# EAGLE design sensor_board_Final (EAGLE 9.6.2)
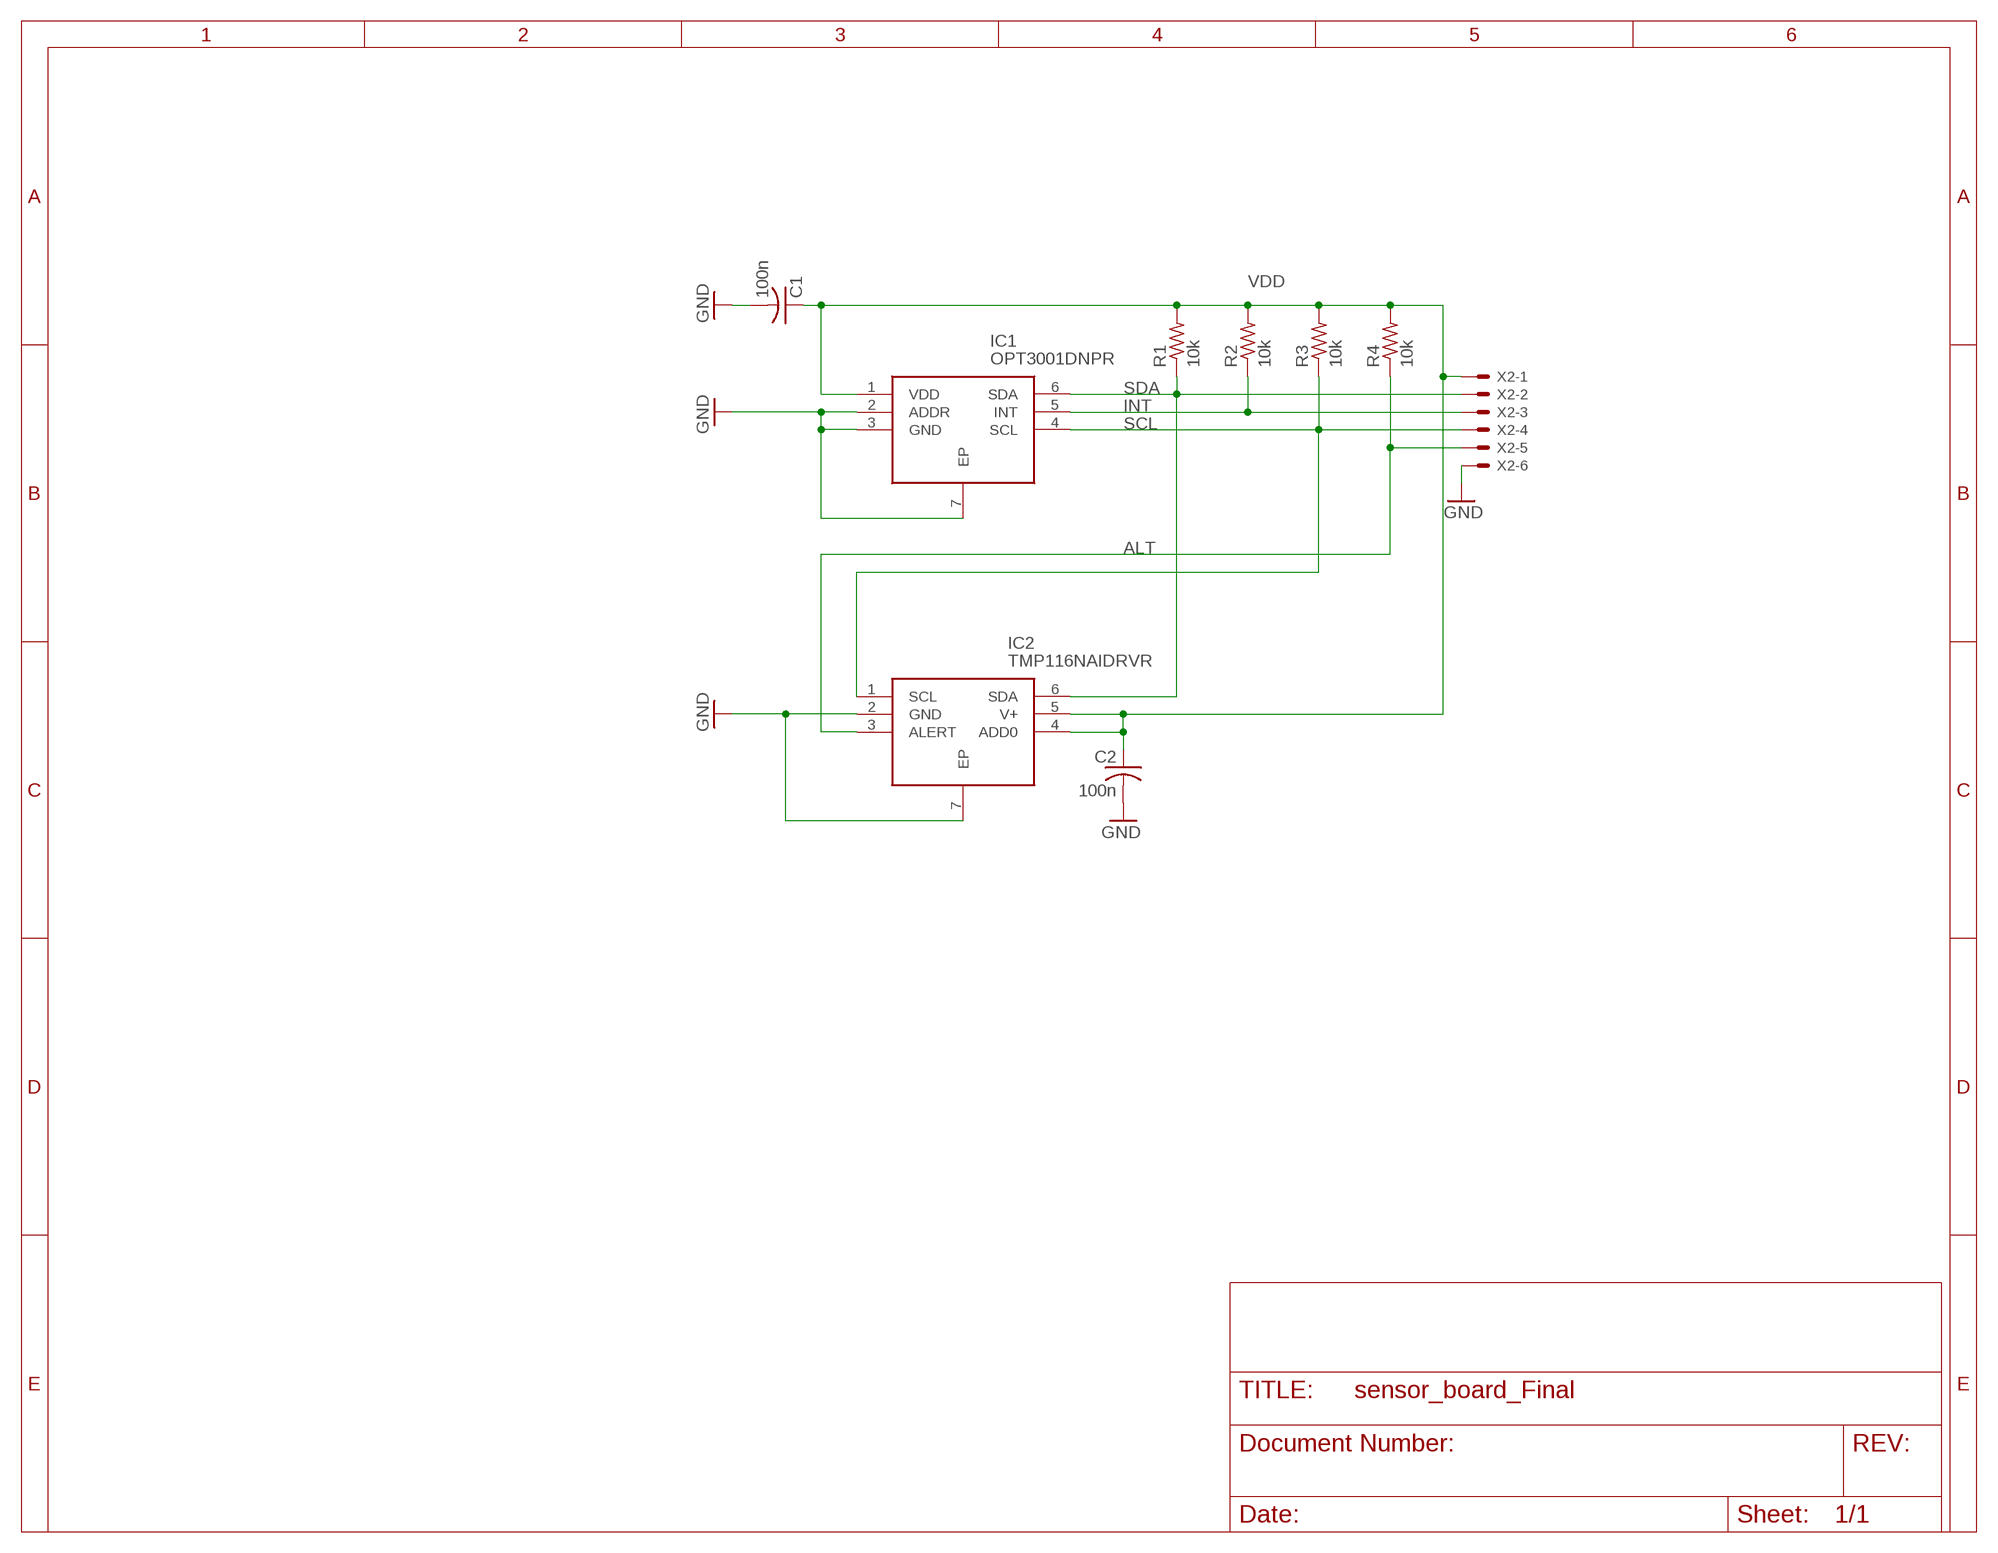
[diagram p0: schematic, sheet 1]

## Parts
C1  100n  C-USC0805  [C0805]
C2  100n  C-USC0805  [C0805]
IC1  OPT3001DNPR  [SON65P200X200X65-7N]
IC2  TMP116NAIDRVR  [SON65P200X200X80-7N]
R1  10k  R-US_R0603  [R0603]
R2  10k  R-US_R0603  [R0603]
R3  10k  R-US_R0603  [R0603]
R4  10k  R-US_R0603  [R0603]
X2  22-23-2061  [22-23-2061]

## Nets
ALT: IC2.3(ALERT) R4.1 X2.5
GND [power]: C1.2 C2.2 IC1.2(ADDR) IC1.3(GND) IC1.7(EP) IC2.2(GND) IC2.7(EP) X2.6
INT: IC1.5(INT) R2.1 X2.3
SCL: IC1.4(SCL) IC2.1(SCL) R3.1 X2.4
SDA: IC1.6(SDA) IC2.6(SDA) R1.1 X2.2
VDD [power]: C1.1 C2.1 IC1.1(VDD) IC2.4(ADD0) IC2.5(V+) R1.2 R2.2 R3.2 R4.2 X2.1

## Library data of the parts
C1 C2 = rcl:C-US: CAPACITOR, American symbol; SPICEPREFIX: C
IC1 = OPT3001DNPR:OPT3001DNPR: Digital Ambient Light Sensor (ALS) With High-Precision Human-Eye Response Source: Datasheet <http://www.ti.com/lit/gpn/opt3001>; ARROW_PART_NUMBER: OPT3001DNPR; ARROW_PRICE-STOCK: https://www.arrow.com/en/products/opt3001dnpr/texas-instruments; DESCRIPTION: Digital Ambient Light Sensor (ALS) With High-Precision Human-Eye Response; HEIGHT: 0.65mm; MANUFACTURER_NAME: Texas Instruments; MANUFACTURER_PART_NUMBER: OPT3001DNPR; MOUSER_PART_NUMBER: 595-OPT3001DNPR; MOUSER_PRICE-STOCK: https://www.mouser.co.uk/ProductDetail/Texas-Instruments/OPT3001DNPR?qs=bZA2O%252B%252B1GJtKOS2%252BWqaE4Q%3D%3D
IC2 = TMP116NAIDRVR:TMP116NAIDRVR: +/-0.2C Accurate Digital Temperature Sensor With NV Memory Source: Datasheet <http://www.ti.com/lit/gpn/tmp116>; ARROW_PART_NUMBER: TMP116NAIDRVR; ARROW_PRICE-STOCK: https://www.arrow.com/en/products/tmp116naidrvr/texas-instruments; DESCRIPTION: +/-0.2C Accurate Digital Temperature Sensor With NV Memory; HEIGHT: 0.8mm; MANUFACTURER_NAME: Texas Instruments; MANUFACTURER_PART_NUMBER: TMP116NAIDRVR; MOUSER_PART_NUMBER: 595-TMP116NAIDRVR; MOUSER_PRICE-STOCK: https://www.mouser.co.uk/ProductDetail/Texas-Instruments/TMP116NAIDRVR?qs=gt1LBUVyoHkjMpHhmYqq%252BQ%3D%3D
R1-R4 = rcl:R-US_: RESISTOR, American symbol; SPICEPREFIX: R
X2 = con-molex:22-23-2061: .100" (2.54mm) Center Header - 6 Pin; MF: MOLEX; MPN: 22-23-2061; OC_FARNELL: 1462922; OC_NEWARK: 27C1933

## Net classes
0 default: width 0.254 mm, drill 0.254 mm, clearance 0.254 mm
1 power: width 0.254 mm, drill 0.254 mm, clearance 0.254 mm

## Board
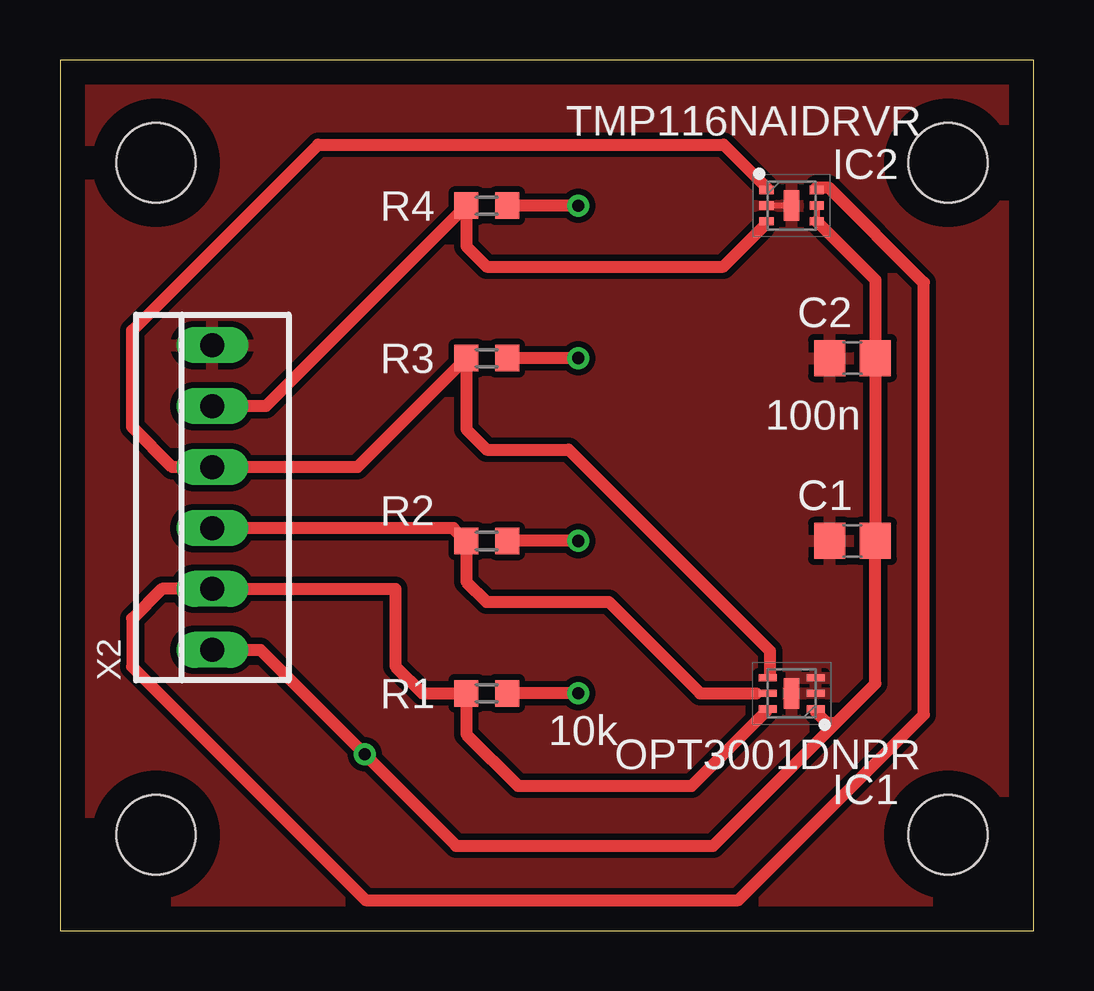
[diagram p1: board, top side]
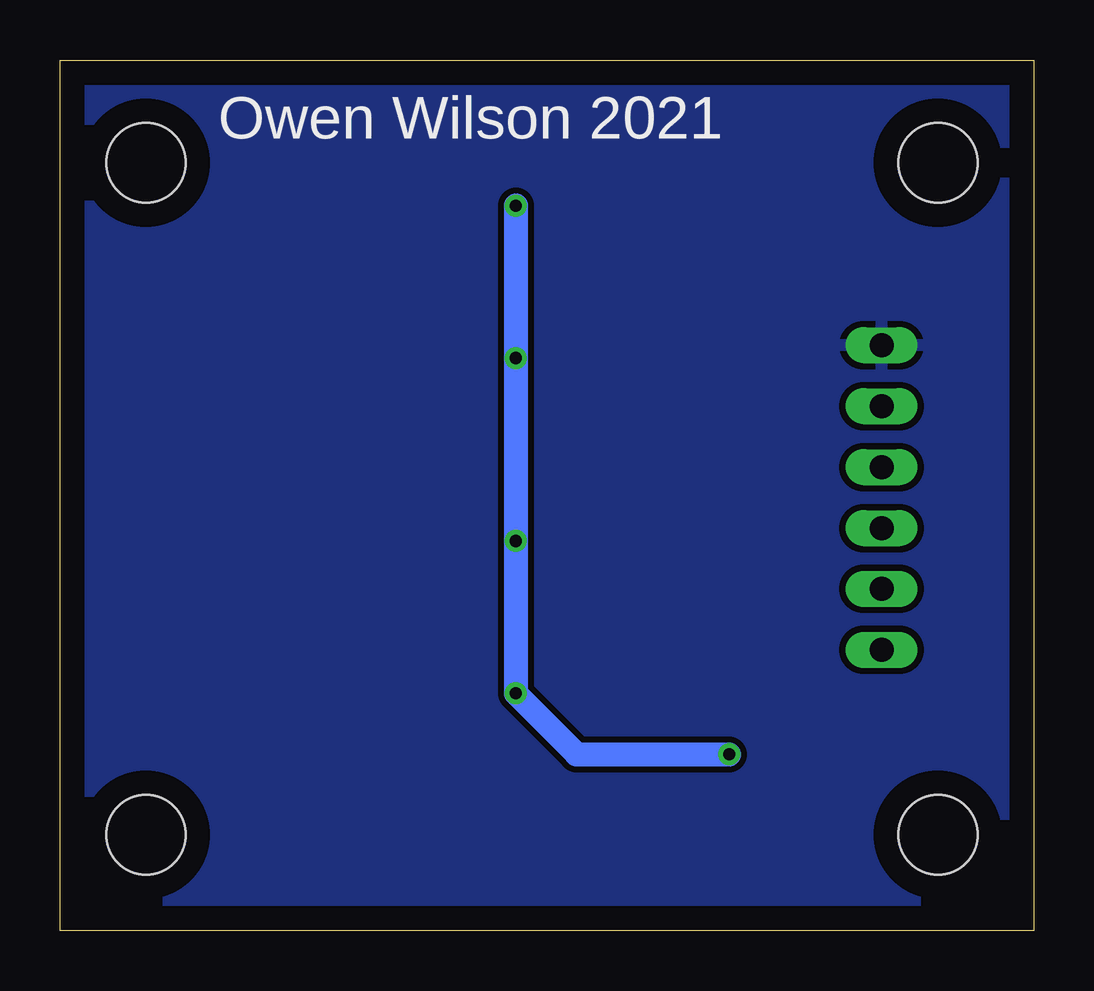
[diagram p2: board, bottom side, seen from below]

Size 40.58 x 36.28 mm. Coordinates in mm from the lower left corner, seen from the top.
Outline: 0,0 40.58,0 40.58,36.28 0,36.28 0,0
Copper layers (1*16): Top 0.035mm / dielectric 1.5mm / Bottom 0.035mm
Design rules "default": minimum track width 8mil, minimum drill 0.35mm, track to track 8mil, track to pad 8mil, pad to pad 8mil, via to via 8mil, smd to smd 8mil, copper to edge 40mil, drill to drill 8mil, minimum pad ring 10mil, minimum via ring 8mil, stop-mask expansion 4mil, vias tented up to drill 0mil, thermal gap 10mil
Holes 3.3 mm at 4,32 4,4 37,4 37,32

### Footprints (pad centres in the part's own frame; a part is rotated, then mirrored left to right if it is on the bottom)
C0805 = smd 1.3 x 1.5: 1 -0.95,0; 2 0.95,0
SON65P200X200X65-7N = smd 0.75 x 0.3: 1 -1,0.65; 2 -1,0; 3 -1,-0.65; 4 1,-0.65; 5 1,0; 6 1,0.65 | smd 0.66 x 1.27: 7 0,0
SON65P200X200X80-7N = smd 0.6 x 0.35: 1 -1.05,0.65; 2 -1.05,0; 3 -1.05,-0.65; 4 1.05,-0.65; 5 1.05,0; 6 1.05,0.65 | smd 0.635 x 1.27: 7 0,0
R0603 = smd 1 x 1.1: 1 -0.85,0; 2 0.85,0
22-23-2061 = drill 1 long: 1 -6.35,0; 2 -3.81,0; 3 -1.27,0; 4 1.27,0; 5 3.81,0; 6 6.35,0

### Placement (x,y rotation side)
C1  33.02,16.24 180 top
C2  33.02,23.86 180 top
IC1  30.48,9.89 180 top
IC2  30.48,30.21 0 top
R1  17.78,9.89 0 top
R2  17.78,16.24 0 top
R3  17.78,23.86 0 top
R4  17.78,30.21 0 top
X2  6.35,18.05 90 top

### Tracks (layer width: path | path; a pad name or v marks a point on that pad's centre or on a via)
ALT
  Top 0.254: 29.43,29.47 IC2.3 29.43,29.46 29.28,29.32
  Top 0.508: X2.5 8.58,21.86 R4.1 16.93,28.52 17.78,27.67 27.64,27.67 29.28,29.32
GND
  Top 0.254: IC2.7 IC2.2
  pour Top: 0,0 40.91,0 40.91,36.29 0,36.29
  pour Bottom: 0,0 40.91,0 40.91,36.29 0,36.29
INT
  Top 0.254: 29.01,9.89 IC1.5
  Top 0.508: X2.3 16.39,16.78 R2.1 16.93,14.55 17.78,13.7 22.86,13.7 26.67,9.89 29.01,9.89
SCL
  Top 0.254: IC1.4 29.59,10.65 | 29.43,30.97 IC2.1
  Top 0.508: 29.59,10.65 29.59,11.65 21.19,20.05 17.78,20.05 16.93,20.9 R3.1 12.39,19.32 X2.4 4.68,19.32 3,21 3,25 10.75,32.75 27.65,32.75 29.43,30.97
SDA
  Top 0.254: IC1.6 29.48,9.2 29.41,9.13 | IC2.6 31.53,30.97
  Top 0.508: 29.41,9.13 26.32,6.04 19.08,6.04 16.93,8.19 R1.1 15.11,9.89 13.97,11.03 13.97,14.24 X2.2 4.24,14.24 3,13 3,11 12.73,1.27 28.27,1.27 36,9 36,27 32.03,30.97 31.53,30.97
VDD  (via drill 0.51)
  Top 0.254: IC1.1 31.48,9.13 31.81,8.81 | IC2.5 IC2.4
  Top 0.508: X2.1 8.35,11.7 v12.7,7.35 16.51,3.54 27.21,3.54 32.34,8.66 | v21.59,16.24 R2.2 | v21.59,23.86 R3.2 | v21.59,9.89 R1.2 | v21.59,30.21 R4.2 | IC2.4 33.97,27.12 C2.1 C1.1 33.97,10.3 32.34,8.66 | 31.5,9.11 31.81,8.81 31.95,8.66 32.34,8.66
  Bottom 1: v21.59,9.89 19.05,7.35 v12.7,7.35 | v21.59,30.21 v21.59,23.86 v21.59,9.89 | v21.59,16.24 v21.59,9.89

### Text on the board
bNames: Owen Wilson 2021